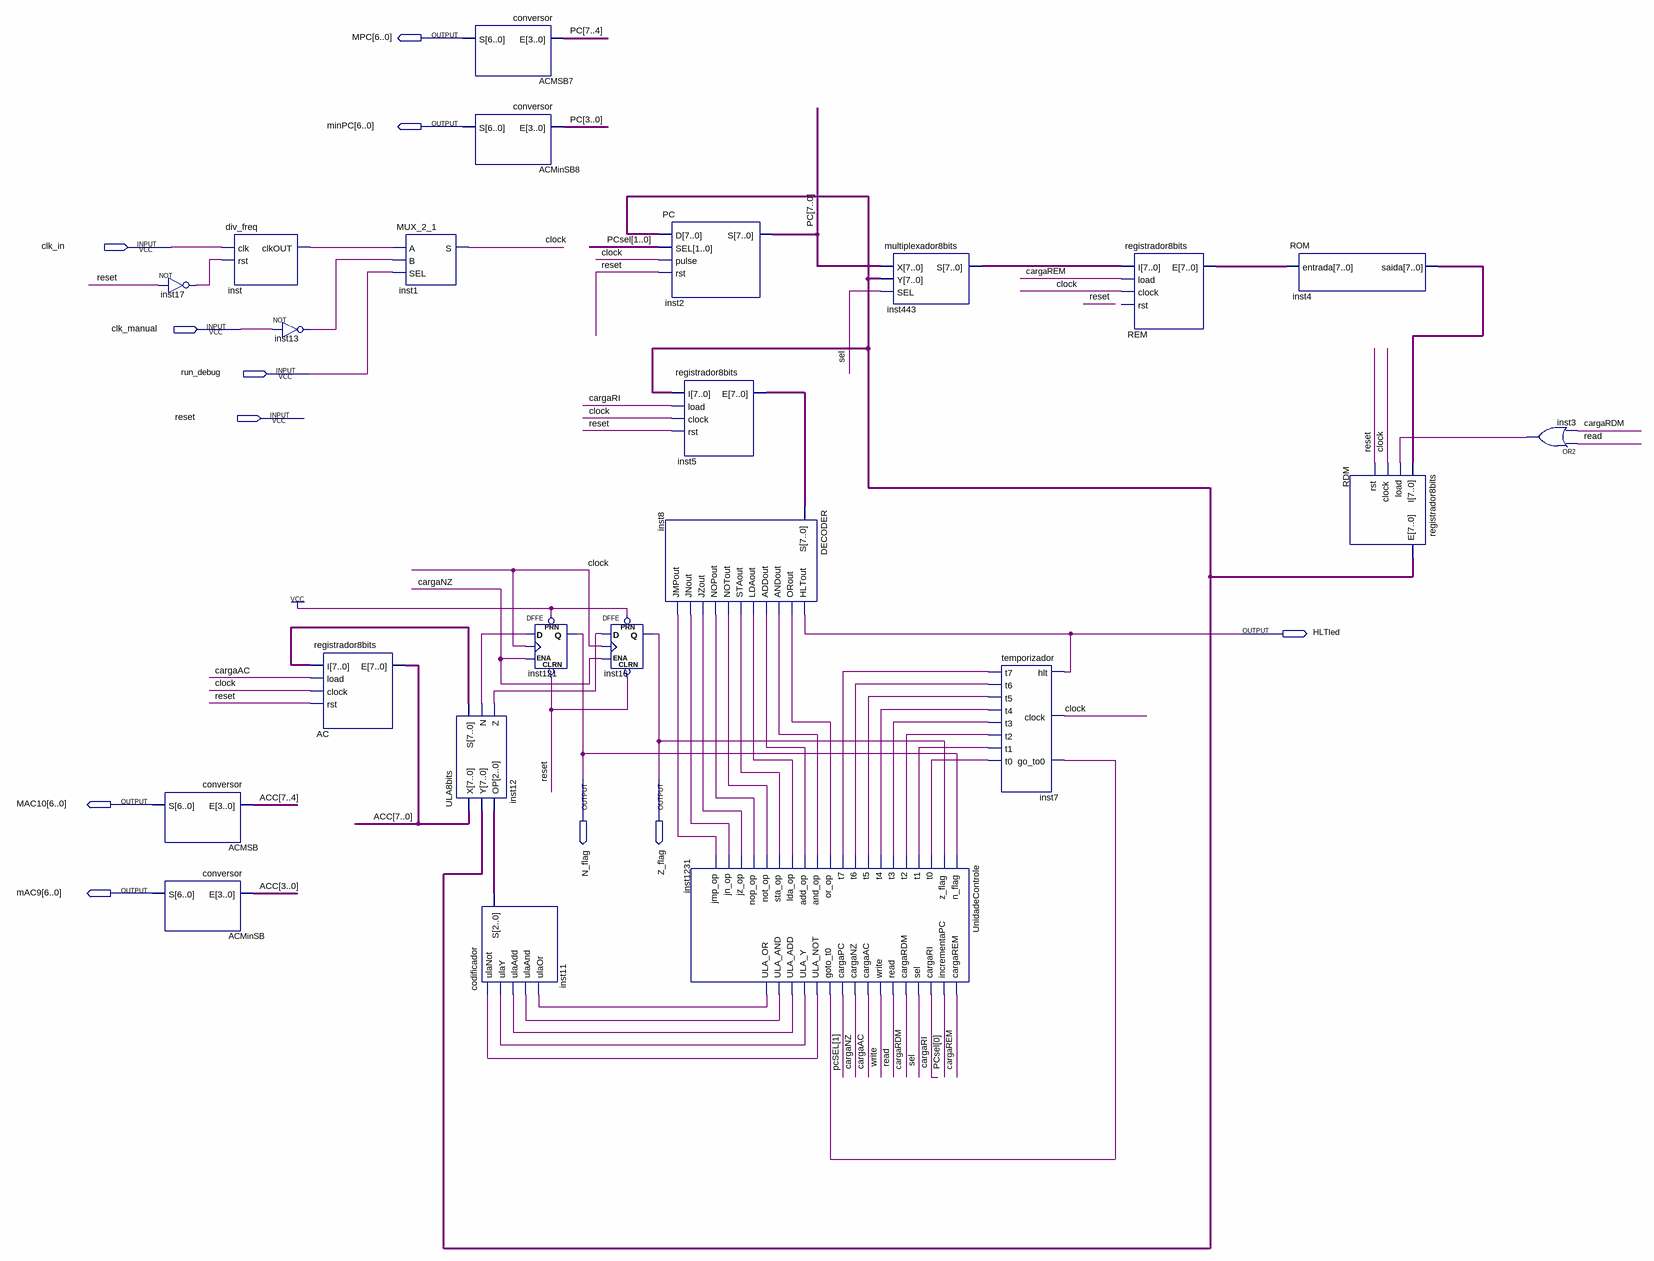
[diagram p0: schematic sheet]
// Quartus schematic neander.bdf as structural Verilog: 23 symbols, 11 pins
module neander (
  input  clk_in,
  input  clk_manual,
  input  run_debug,
  input  reset,
  output [6:0] MPC,
  output [6:0] minPC,
  output HLTled,
  output N_flag,
  output Z_flag,
  output [6:0] MAC10,
  output [6:0] mAC9
);

  wire cargaAC, cargaNZ, cargaRDM, cargaREM, cargaRI, clock, inst3_out, inst7_t0, inst7_t1, inst7_t2,
       inst7_t3, inst7_t4, inst7_t5, inst7_t6, inst7_t7, inst8_addout, inst8_andout, inst8_jmpout,
       inst8_jnout, inst8_jzout, inst8_ldaout, inst8_nopout, inst8_notout, inst8_orout, inst8_staout,
       inst12_n, inst12_z, inst13_out, inst17_out, inst1231_goto_t0, inst1231_ula_add, inst1231_ula_and,
       inst1231_ula_not, inst1231_ula_or, inst1231_ula_y, inst_clkout, read, sel, write;
  wire [1:0] PCsel;
  wire [2:0] inst11_s;
  wire [7:0] ACC, inst4_saida, inst5_e, inst12_s, inst443_s, PC, RDM_e, REM_e;

  not inst17 (inst17_out, reset);
  conversor ACMSB (.E(ACC[7:4]), .S(MAC10));
  conversor ACMinSB (.E(ACC[3:0]), .S(mAC9));
  div_freq inst (.clk(clk_in), .rst(inst17_out), .clkOUT(inst_clkout));
  not inst13 (inst13_out, clk_manual);
  registrador8bits AC (.I(inst12_s), .load(cargaAC), .clock(clock), .rst(reset), .E(ACC));
  MUX_2_1 inst1 (.A(inst_clkout), .B(inst13_out), .SEL(run_debug), .S(clock));
  conversor ACMSB7 (.E(PC[7:4]), .S(MPC));
  conversor ACMinSB8 (.E(PC[3:0]), .S(minPC));
  ULA8bits inst12 (.X(ACC), .Y(RDM_e), .OP(inst11_s), .S(inst12_s), .N(inst12_n), .Z(inst12_z));
  codificador inst11 (
    .ulaAnd(inst1231_ula_and), .ulaNot(inst1231_ula_not), .ulaOr(inst1231_ula_or), .ulaY(inst1231_ula_y),
    .ulaAdd(inst1231_ula_add), .S(inst11_s));
  DFFE inst121 (.PRN(1'b1), .CLRN(reset), .D(inst12_n), .CLK(clock), .ENA(cargaNZ), .Q(N_flag));
  DFFE inst16 (.PRN(1'b1), .CLRN(reset), .D(inst12_z), .CLK(clock), .ENA(cargaNZ), .Q(Z_flag));
  PC inst2 (.D(RDM_e), .SEL(PCsel), .pulse(clock), .rst(reset), .S(PC));
  registrador8bits inst5 (.I(RDM_e), .load(cargaRI), .clock(clock), .rst(reset), .E(inst5_e));
  DECODER inst8 (
    .S(inst5_e), .HLTout(HLTled), .JZout(inst8_jzout), .JNout(inst8_jnout), .JMPout(inst8_jmpout),
    .NOTout(inst8_notout), .ANDout(inst8_andout), .ORout(inst8_orout), .ADDout(inst8_addout),
    .LDAout(inst8_ldaout), .STAout(inst8_staout), .NOPout(inst8_nopout));
  UnidadeControle inst1231 (
    .n_flag(N_flag), .z_flag(Z_flag), .t0(inst7_t0), .t1(inst7_t1), .t2(inst7_t2), .t3(inst7_t3),
    .t4(inst7_t4), .t5(inst7_t5), .t6(inst7_t6), .t7(inst7_t7), .or_op(inst8_orout), .and_op(inst8_andout),
    .add_op(inst8_addout), .lda_op(inst8_ldaout), .sta_op(inst8_staout), .not_op(inst8_notout),
    .nop_op(inst8_nopout), .jz_op(inst8_jzout), .jn_op(inst8_jnout), .jmp_op(inst8_jmpout),
    .cargaREM(cargaREM), .incrementaPC(PCsel[0]), .cargaRI(cargaRI), .sel(sel), .cargaRDM(cargaRDM),
    .read(read), .write(write), .cargaAC(cargaAC), .cargaNZ(cargaNZ), .cargaPC(PCsel[1]),
    .goto_t0(inst1231_goto_t0), .ULA_NOT(inst1231_ula_not), .ULA_Y(inst1231_ula_y),
    .ULA_ADD(inst1231_ula_add), .ULA_AND(inst1231_ula_and), .ULA_OR(inst1231_ula_or));
  multiplexador8bits inst443 (.X(PC), .Y(RDM_e), .SEL(sel), .S(inst443_s));
  temporizador inst7 (
    .go_to0(inst1231_goto_t0), .hlt(HLTled), .clock(clock), .t0(inst7_t0), .t1(inst7_t1), .t2(inst7_t2),
    .t3(inst7_t3), .t4(inst7_t4), .t5(inst7_t5), .t6(inst7_t6), .t7(inst7_t7));
  registrador8bits REM (.I(inst443_s), .load(cargaREM), .clock(clock), .E(REM_e));  // open: rst
  ROM inst4 (.entrada(REM_e), .saida(inst4_saida));
  registrador8bits RDM (.I(inst4_saida), .load(inst3_out), .clock(clock), .rst(reset), .E(RDM_e));
  or inst3 (inst3_out, read, cargaRDM);
endmodule
